# Altium schematic sheet FlexEMG_v0r0_BATT-CHARGER.SchDoc
size A
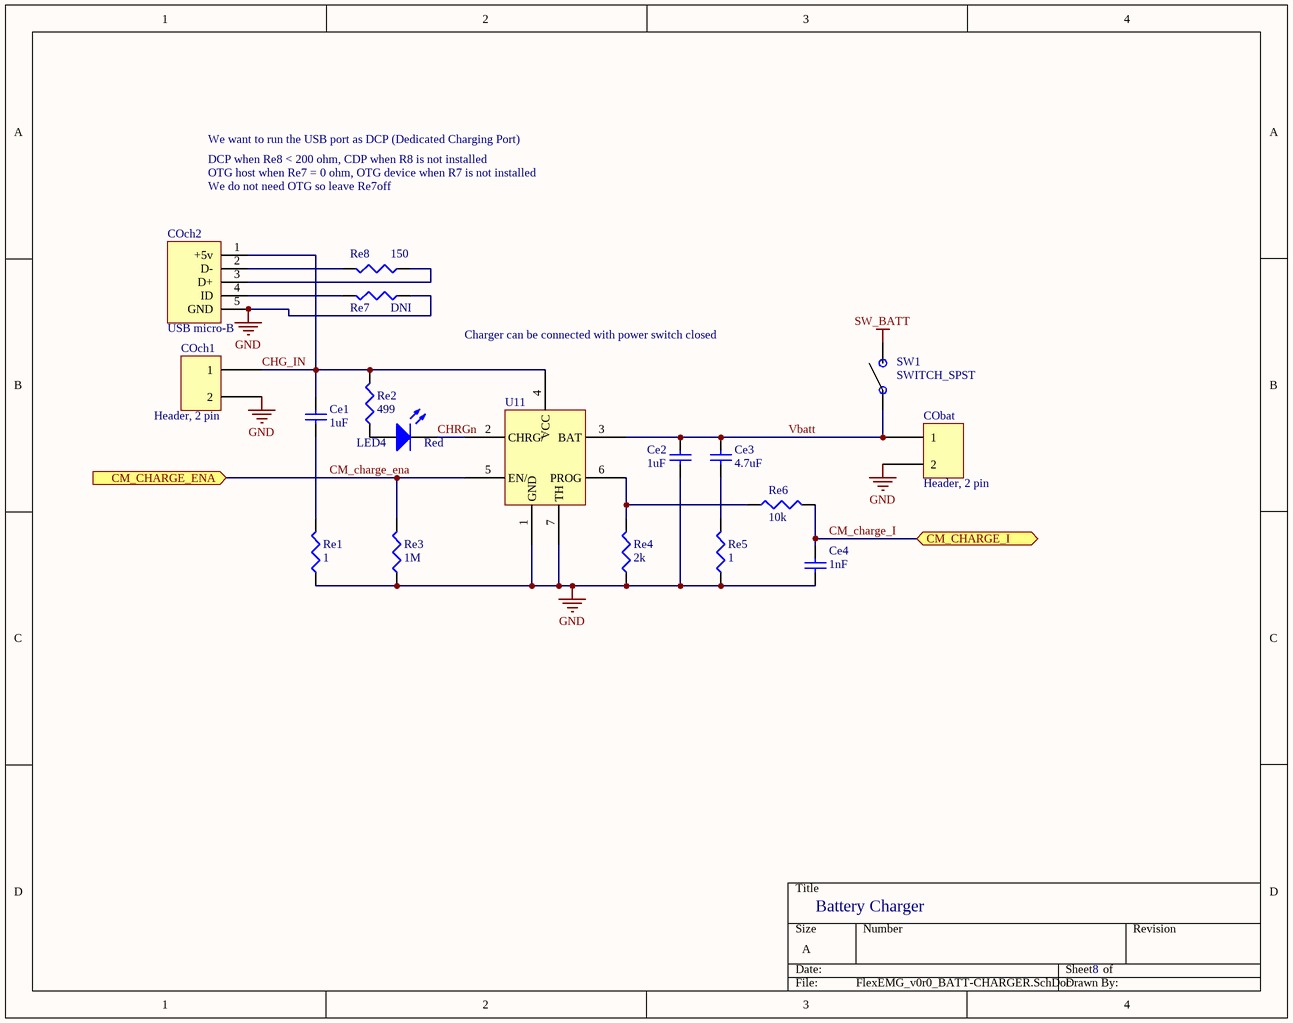
[diagram p0: FlexEMG_v0r0_BATT-CHARGER.SchDoc]

## Parts
Ce1  value 1uF  [c0402-TDK-C]  (hidden comment: C1005X5R1C105M050BC)
Ce2  value 1uF  [c0402-TDK-C]  (hidden comment: C1005X5R1C105M050BC)
Ce3  value 4.7uF  [c0603-Murata-GR]  (hidden comment: GRM188R6YA475KE15D)
Ce4  value 1nF  [c0402-Murata-GR]  (hidden comment: GRM155R61H102KA01D)
CObat  Header, 2 pin  [Header, 2 pin, 2mm(79mil)]
COch1  Header, 2 pin  [Header, 2 pin, 2mm(79mil)]
COch2  USB micro-B  [USB-microB_amp_10118194-0001LF]
LED4  Color: Red  [LED-0603]
Re1  value 1  [0402_p]  (hidden comment: ERJ-2BQF1R0X)
Re2  value 499  [0402_p]  (hidden comment: ERJ-2RKF4990X)
Re3  value 1M  [0402_p]  (hidden comment: ERJ-2RKF1004X)
Re4  value 2k  [0402_p]  (hidden comment: ERJ-2RKF2001X)
Re5  value 1  [0402_p]  (hidden comment: ERJ-2BQF1R0X)
Re6  value 10k  [0402_p]  (hidden comment: ERJ-2RKF1002X)
Re7  DNI  [0402_p]
Re8  value 150  [0402_p]  (hidden comment: ERJ-PA2J151X)
SW1  SWITCH_SPST  [SWITCH_SPST_CHS-01TB]
U11  LTC4065EDC#TRMPBF  [DFN-6_LT]  (value not drawn)

## Ports
CM_CHARGE_ENA (in), CM_CHARGE_I (bidir)

## Nets
GND: Ce2.1 Ce4.1 CObat.2 COch1.2 COch2.5(GND) Re1.1 Re3.1 Re4.1 Re5.1 Re7.1 U11.1(GND) U11.7(TH)
SW_BATT: SW1.1
CHG_IN: Ce1.2 COch1.1 COch2.1(+5v) Re2.2 U11.4(VCC)
CHRGn: LED4.2(K) U11.2(CHRG/)
CM_charge_ena: Re3.2 U11.5(EN/) ; port CM_CHARGE_ENA
CM_charge_I: Ce4.2 Re6.2 ; port CM_CHARGE_I
Vbatt: Ce2.2 Ce3.2 CObat.1 SW1.2 U11.3(BAT)
NetCe1_1: Ce1.1 Re1.2
NetCe3_1: Ce3.1 Re5.2
NetCOch2_2: COch2.2(D-) Re8.2
NetCOch2_3: COch2.3(D+) Re8.1
NetCOch2_4: COch2.4(ID) Re7.2
NetLED4_1: LED4.1(A) Re2.1
NetRe4_2: Re4.2 Re6.1 U11.6(PROG)

Not connected (* = marked no-connect by the designer): COch2 6 7 8 9

## Notes on the sheet
- DCP when Re8 < 200 ohm, CDP when R8 is not installed
- We want to run the USB port as DCP (Dedicated Charging Port)
- OTG host when Re7 = 0 ohm, OTG device when R7 is not installed
- We do not need OTG so leave Re7off
- Charger can be connected with power switch closed
- Battery Charger
- 8

## Library data of the parts
Ce1 Ce2 = Cap: CAP CER 1UF 16V X5R 0402; Manufacturer: TDK; Supplier: Digikey; Supplier PN: 445-9073-1-ND; Manufacturer PN: C1005X5R1C105M050BC
Ce3 = Cap: CAP CER 4.7UF 35V X5R 0603; Manufacturer: Murata; Supplier: Digikey; Supplier PN: 490-7205-1-ND; Manufacturer PN: GRM188R6YA475KE15D
Ce4 = Cap: CAP CER 1000PF 50V X5R 0402; Manufacturer: Murata; Supplier: Digikey; Supplier PN: 490-6316-1-ND; Manufacturer PN: GRM155R61H102KA01D
CObat COch1 = Header, 2 pin: Header 1x2; Manufacturer: Samtec; Manufacturer PN: TMM-102-03-T-S; Supplier: Digikey; Supplier PN: SAM8977-ND
COch2 = USB-microB: USB micro-B connector; Manufacturer: Amphenol; Manufacturer PN: 10118194-0001LF; Supplier: Digikey; Supplier PN: 609-4618-1-ND
LED4 = LED: LED RED CLEAR 0603 SMD; Manufacturer: Rohm; Manufacturer PN: SML-311UTT86; Supplier: Digikey; Supplier PN: 511-1304-1-ND
Re1 Re5 = Resistor: RES SMD 1 OHM 1% 1/6W 0402; Manufacturer: Panasonic; Manufacturer PN: ERJ-2BQF1R0X; Supplier: Digikey; Supplier P/N: P17252CT-ND; Power: 1/6W; Package: 0402
Re2 = Resistor: RES SMD 499 OHM 1% 1/10W 0402; Manufacturer: Panasonic; Manufacturer PN: ERJ-2RKF4990X; Supplier: Digikey; Supplier P/N: P499LCT-ND; Power: 1/10W; Package: 0402
Re3 = Resistor: RES SMD 1M OHM 1% 1/10W 0402; Manufacturer: Panasonic; Manufacturer PN: ERJ-2RKF1004X; Supplier: Digikey; Supplier P/N: P1.00MLCT-ND; Power: 1/10W; Package: 0402
Re4 = Resistor: RES SMD 2K OHM 1% 1/10W 0402; Manufacturer: Panasonic; Manufacturer PN: ERJ-2RKF2001X; Supplier: Digikey; Supplier P/N: P2.00KLCT-ND; Power: 1/10W; Package: 0402
Re6 = Resistor: RES SMD 10K OHM 1% 1/10W 0402; Manufacturer: Panasonic; Manufacturer PN: ERJ-2RKF1002X; Supplier: Digikey; Supplier P/N: P10.0KLCT-ND; Power: 1/10W; Package: 0402
Re7 = Resistor: Manufacturer: Panasonic; Power: 1/10W; Manufacturer PN: DNI; Supplier: Digikey; Package: 0402
Re8 = Resistor: RES SMD 150 OHM 5% 1/5W 0402; Manufacturer: Panasonic; Power: 1/10W; Manufacturer PN: ERJ-PA2J151X; Supplier: Digikey; Supplier P/N: P17188CT-ND; Package: 0402
SW1 = SWITCH_SPST: SWITCH SLIDE DIP SPST 100MA 6V; Manufacturer: Copal; Manufacturer PN: CHS-01TB; Supplier: Digikey; Supplier PN: 563-1004-1-ND
U11 = LTC4065EDC: IC CHARGER BATT LI-ON 6-DFN; Manufacturer: LT; Note: 4.4v float version is available (4.2 is standard): LTC4065EDC-4.4; Manufacturer PN: LTC4065EDC#TRMPBF; Supplier: Digikey; Supplier PN: LTC4065EDC#TRMPBFCT-ND